# EAGLE design DESIGN8DL (EAGLE 9.6.2)
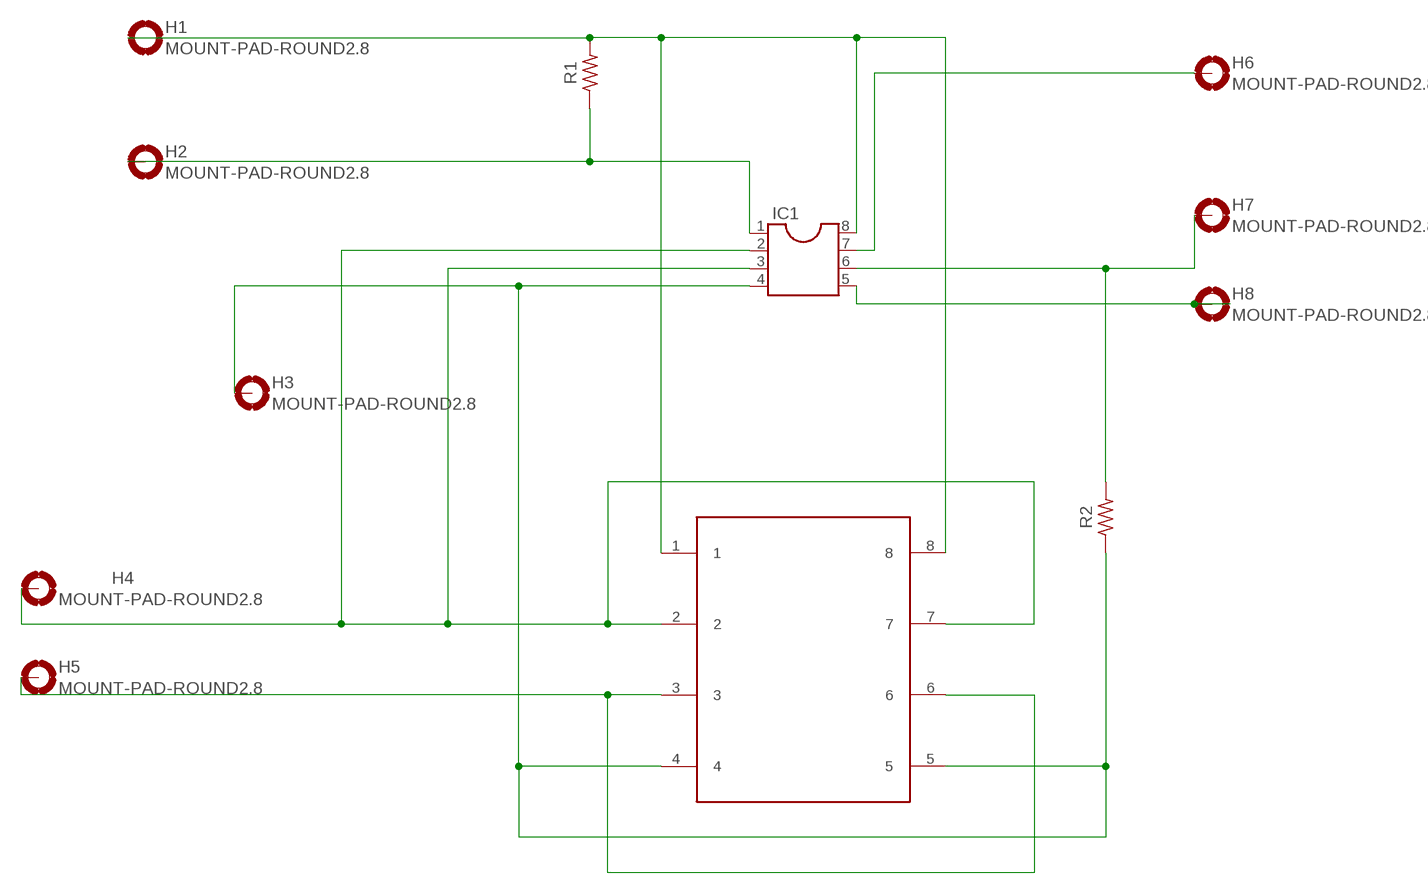
[diagram p0: schematic, sheet 1]

## Parts
H1  MOUNT-PAD-ROUND2.8  [2,8-PAD]
H2  MOUNT-PAD-ROUND2.8  [2,8-PAD]
H3  MOUNT-PAD-ROUND2.8  [2,8-PAD]
H4  MOUNT-PAD-ROUND2.8  [2,8-PAD]
H5  MOUNT-PAD-ROUND2.8  [2,8-PAD]
H6  MOUNT-PAD-ROUND2.8  [2,8-PAD]
H7  MOUNT-PAD-ROUND2.8  [2,8-PAD]
H8  MOUNT-PAD-ROUND2.8  [2,8-PAD]
IC1  DIL8  [DIL08]
R1  R-US_AXIAL-7.2MM-PITCH  [RESAD724W46L381D178B]
R2  R-US_AXIAL-7.2MM-PITCH  [RESAD724W46L381D178B]
U$4  JOYPAD  [JOYPAD]

## Nets
N$1: H1.B2,8(MOUNT) IC1.8 R1.2 U$4.1 U$4.8
N$2: H2.B2,8(MOUNT) IC1.1 R1.1
N$3: H6.B2,8(MOUNT) IC1.7
N$4: H7.B2,8(MOUNT) IC1.6 R2.2
N$5: H8.B2,8(MOUNT) IC1.5
N$7: H4.B2,8(MOUNT) IC1.2 IC1.3 U$4.2 U$4.7
N$8: H5.B2,8(MOUNT) U$4.3 U$4.6
N$9: H3.B2,8(MOUNT) IC1.4 R2.1 U$4.4 U$4.5

## Library data of the parts
H1-H8 = holes:MOUNT-PAD-ROUND: MOUNTING PAD, round
IC1 = ic-package:DIL8: Dual In Line / Socket
R1 R2 = Resistor:R-US: Resistor Fixed - ANSI; CATEGORY: Resistor; SUB-CATEGORY: Fixed
U$4 = joypad:JOYPAD

## Board
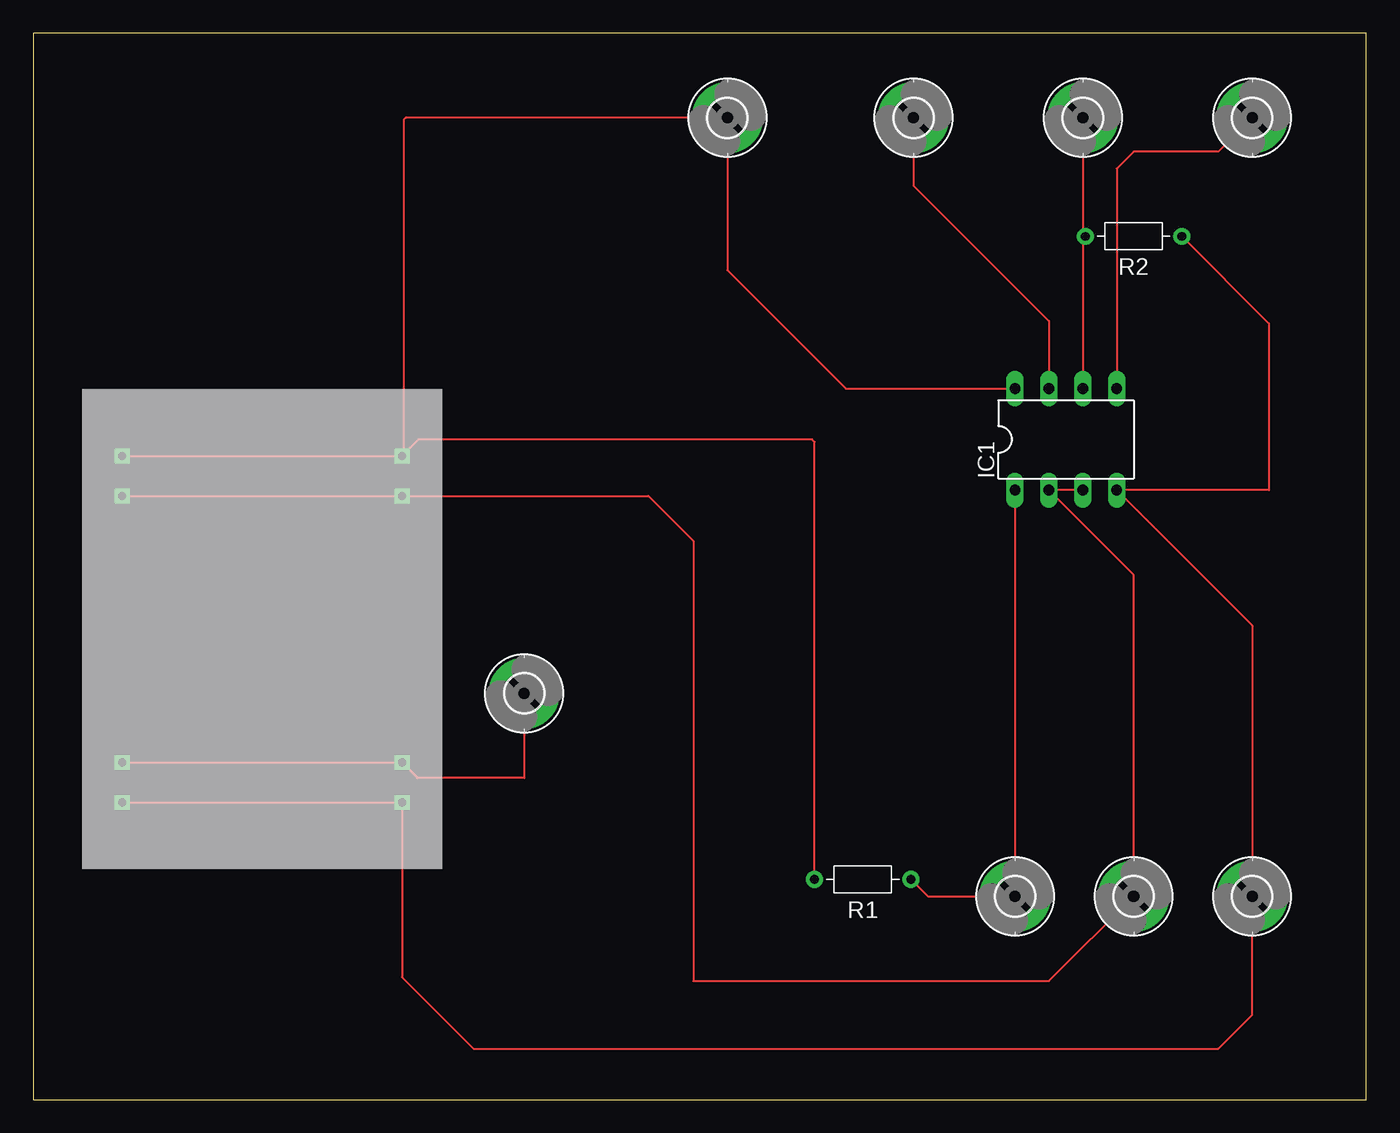
[diagram p1: board, top side]

Size 100 x 80 mm. Coordinates in mm from the lower left corner, seen from the top.
Outline: 0,0 100,0 100,80 0,80 0,0
Copper layers (1*16): Top 0.035mm / dielectric 1.5mm / Bottom 0.035mm
Design rules "default": minimum track width 6mil, minimum drill 0.35mm, track to track 6mil, track to pad 6mil, pad to pad 6mil, via to via 6mil, smd to smd 6mil, copper to edge 40mil, drill to drill 6mil, minimum pad ring 10mil, minimum via ring 8mil, stop-mask expansion 4mil, vias tented up to drill 0mil, thermal gap 10mil

### Footprints (pad centres in the part's own frame; a part is rotated, then mirrored left to right if it is on the bottom)
2,8-PAD = drill 2.8 pad 5.334: B2,8 0,0
DIL08 = drill 0.813 long: 1 -3.81,-3.81; 2 -1.27,-3.81; 3 1.27,-3.81; 4 3.81,-3.81; 5 3.81,3.81; 6 1.27,3.81; 7 -1.27,3.81; 8 -3.81,3.81
RESAD724W46L381D178B = drill 0.66 pad 1.26: 1 -3.62,0; 2 3.62,0
JOYPAD = drill 0.6 square: 1 -67,14; 2 -67,11; 3 -67,-9; 4 -67,-12; 5 -46,-12; 6 -46,-9; 7 -46,11; 8 -46,14

### Placement (x,y rotation side)
H1  52.07,73.66 0 top
H2  73.66,15.24 0 top
H3  91.44,15.24 0 top
H4  82.55,15.24 0 top
H5  36.83,30.48 0 top
H6  66.04,73.66 0 top
H7  78.74,73.66 0 top
H8  91.44,73.66 0 top
IC1  77.47,49.53 0 top
R1  62.23,16.51 180 top
R2  82.55,64.77 180 top
U$4  73.66,34.29 0 top

### Tracks (layer width: path | path; a pad name or v marks a point on that pad's centre or on a via)
N$1
  Top 0.152: R1.2 58.61,49.34 58.42,49.53 28.9,49.53 27.79,48.41 | 27.79,48.41 27.79,73.5 27.94,73.66 H1.B2,8 52.07,62.23 60.96,53.34 IC1.8 | U$4.1 U$4.8 27.79,48.41
N$2
  Top 0.152: IC1.1 H2.B2,8 67.12,15.24 R1.1
N$3
  Top 0.152: H6.B2,8 66.04,68.58 76.2,58.42 IC1.7
N$4
  Top 0.152: H7.B2,8 78.74,64.96 R2.2 78.74,64.58 IC1.6
N$5
  Top 0.152: H8.B2,8 88.9,71.12 82.55,71.12 81.28,69.85 IC1.5
N$7
  Top 0.152: U$4.2 U$4.7 46.15,45.29 49.53,41.91 49.53,8.89 76.2,8.89 H4.B2,8 82.55,39.37 IC1.2 IC1.3
N$8
  Top 0.152: U$4.3 U$4.6 28.82,24.13 36.83,24.13 H5.B2,8
N$9
  Top 0.152: U$4.4 U$4.5 27.66,9.17 33.02,3.81 88.9,3.81 91.44,6.35 H3.B2,8 91.44,35.56 IC1.4 92.71,45.72 92.71,58.23 R2.1